# Altium schematic sheet Micro SD-Card . USB2.0.SchDoc
size A4; Date: 2026/04/16; ApprovedBy: NA; Author: 邱上峯; CompanyName: JFM常裕富士機工; Engineer: 邱上峯; Revision: V1.0; SheetNumber: 5; SheetTotal: 8; Pcb Name: NA
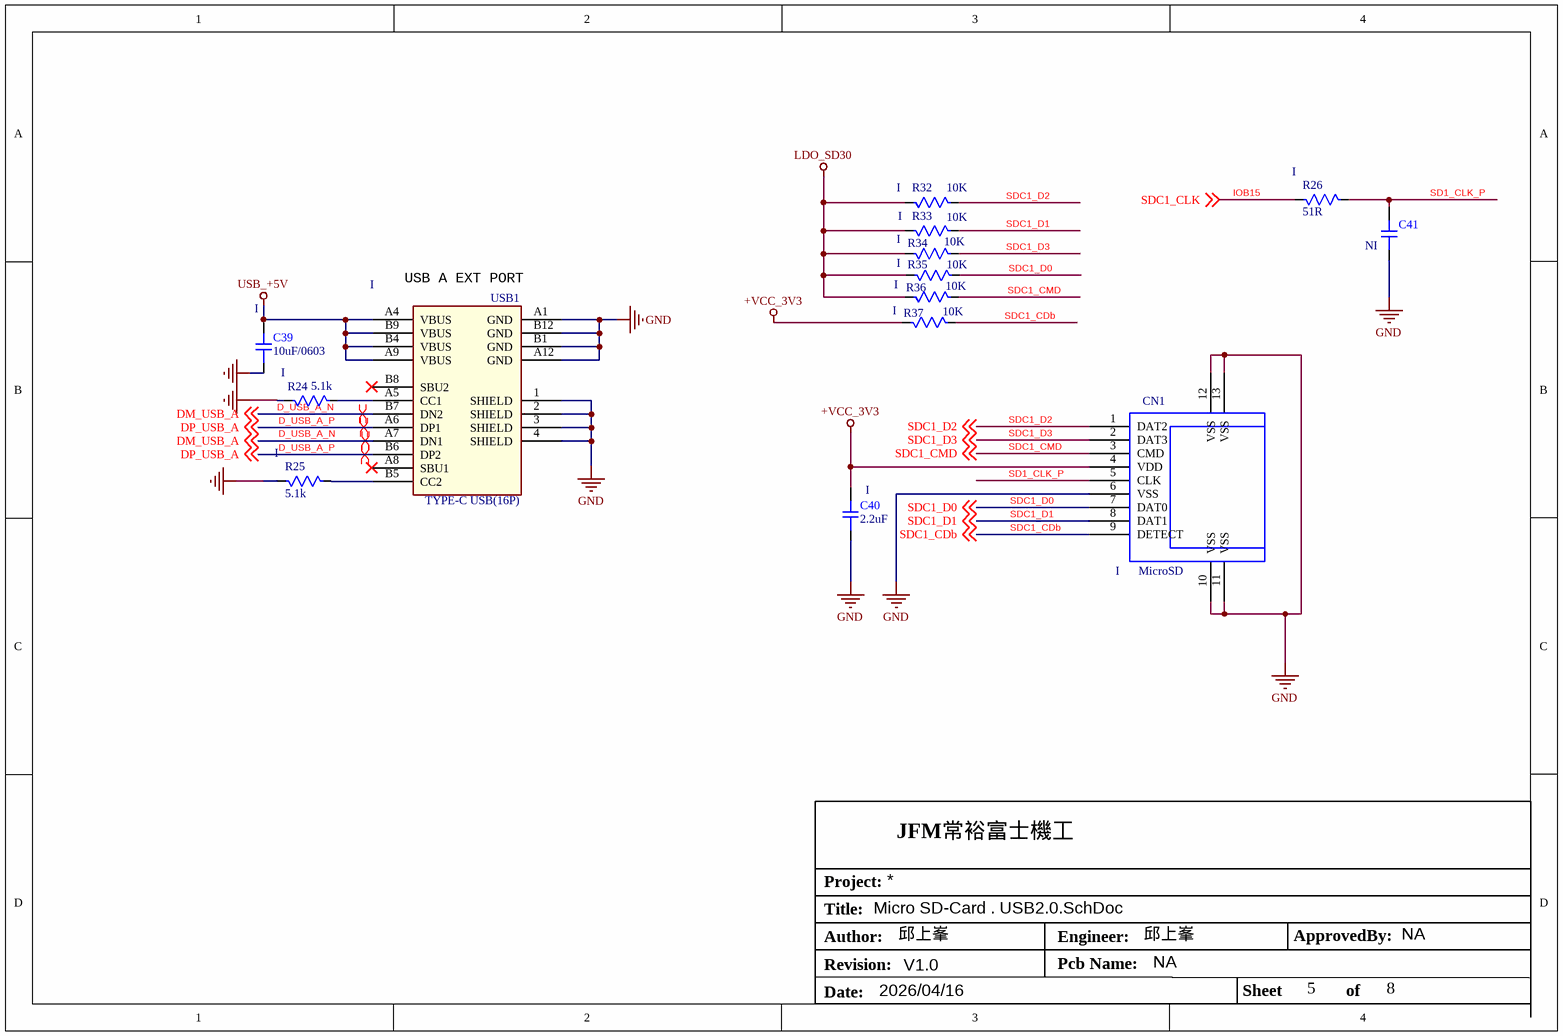
[diagram p0: Micro SD-Card . USB2.0.SchDoc]

## Parts
C39  10uF/0603  BOM: I  [C0603]
C40  2.2uF  BOM: I  [C0402]
C41  NI  [C0402]
CN1  MicroSD  BOM: I  [MicroSD]
R24  5.1k  BOM: I  [R0603]
R25  5.1k  BOM: I  [R0603]
R26  51R  BOM: I  [R0603]
R32  10K  BOM: I  [R0402]
R33  10K  BOM: I  [R0402]
R34  10K  BOM: I  [R0402]
R35  10K  BOM: I  [R0402]
R36  10K  BOM: I  [R0402]
R37  10K  BOM: I  [R0402]
USB1  TYPE-C USB(16P)  BOM: I  [Type C USB (16P)]

## Nets
+VCC_3V3: C40.2 CN1.4(VDD) R37.1
GND: C39.1 C40.1 C41.1 CN1.6(VSS) CN1.10(VSS) CN1.11(VSS) CN1.12(VSS) CN1.13(VSS) R24.1 R25.1 USB1.1(SHIELD) USB1.2(SHIELD) USB1.3(SHIELD) USB1.4(SHIELD) USB1.A1(GND) USB1.A12(GND) USB1.B1(GND) USB1.B12(GND)
LDO_SD30: R32.1 R33.1 R34.1 R35.1 R36.1
USB_+5V: C39.2 USB1.A4(VBUS) USB1.A9(VBUS) USB1.B4(VBUS) USB1.B9(VBUS)
D_USB_A_N: USB1.A7(DN1) USB1.B7(DN2) ; off-sheet DM_USB_A  [also labelled DM_USB_A]
D_USB_A_P: USB1.A6(DP1) USB1.B6(DP2) ; off-sheet DP_USB_A  [also labelled DP_USB_A]
IOB15: R26.1 ; off-sheet SDC1_CLK  [also labelled SDC1_CLK]
SD1_CLK_P: C41.2 CN1.5(CLK) R26.2
SDC1_CDb: CN1.9(DETECT) R37.2 ; off-sheet SDC1_CDb
SDC1_CMD: CN1.3(CMD) R36.2 ; off-sheet SDC1_CMD
SDC1_D0: CN1.7(DAT0) R35.2 ; off-sheet SDC1_D0
SDC1_D1: CN1.8(DAT1) R33.2 ; off-sheet SDC1_D1
SDC1_D2: CN1.1(DAT2) R32.2 ; off-sheet SDC1_D2
SDC1_D3: CN1.2(DAT3) R34.2 ; off-sheet SDC1_D3
NetR24_2: R24.2 USB1.A5(CC1)
NetR25_2: R25.2 USB1.B5(CC2)

Not connected (* = marked no-connect by the designer): USB1 A8(SBU1) B8(SBU2)

## Layout directives
differential pair: D_USB_A_N, D_USB_A_P

## Notes on the sheet
- (near USB1) USB A EXT PORT
- Title:
- Project:
- Date:
- Author:
- Revision:
- Engineer:
- Pcb Name:
- Sheet
- ApprovedBy:
- of

## Library data of the parts
C39-C41 = Cap
  C41: BOM: NI
R24-R26 R32-R37 = Res
USB1 = TYPE-C USB_1: CUC006AHP-BPIN